# Altium schematic sheet PortSplitters.SCHDOC
size A4; DocumentNumber: 2; SheetNumber: 2; SheetTotal: 2
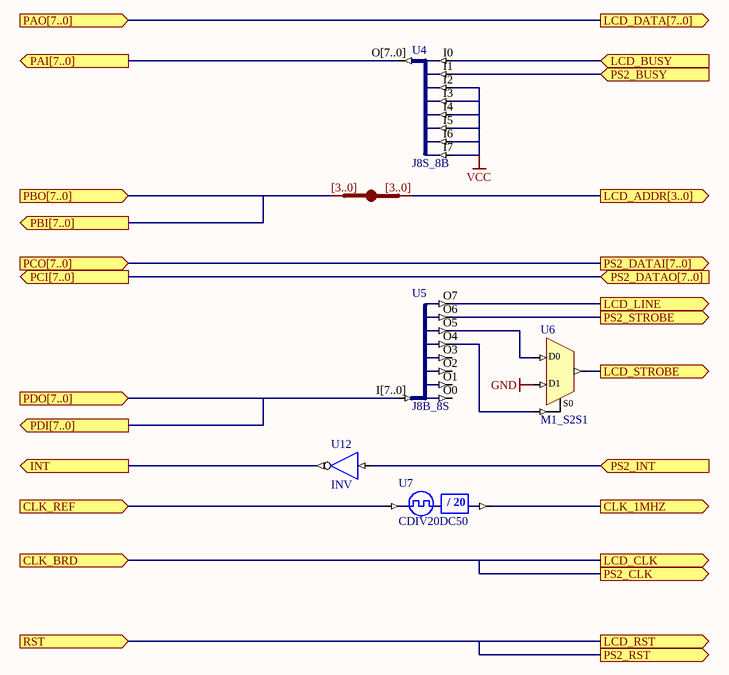
[diagram p0: PortSplitters.SCHDOC]

## Parts
JB_AUTO?  IndexA: [3..0]  (hidden comment: JB)
U4  J8S_8B
U5  J8B_8S
U6  M1_S2S1
U7  CDIV20DC50
U12  INV

## Ports
CLK_1MHZ (out), CLK_BRD (in), CLK_REF (in), INT (out), LCD_ADDR[3..0] (out), LCD_BUSY (in), LCD_CLK (out), LCD_DATA[7..0] (out), LCD_LINE (out), LCD_RST (out), LCD_STROBE (out), PAI[7..0] (out), PAO[7..0] (in), PBI[7..0] (out), PBO[7..0] (in), PCI[7..0] (out), PCO[7..0] (in), PDI[7..0] (out), PDO[7..0] (in), PS2_BUSY (in), PS2_CLK (out), PS2_DATAI[7..0] (out), PS2_DATAO[7..0] (in), PS2_INT (in), PS2_RST (out), PS2_STROBE (out), RST (in)

## Nets
GND: U6.D1
VCC: U4.I2 U4.I3 U4.I4 U4.I5 U4.I6 U4.I7
CLK_1MHZ: U7.CLKDV ; port CLK_1MHZ
CLK_BRD: port CLK_BRD, port LCD_CLK, port PS2_CLK
CLK_REF: U7.CLKIN ; port CLK_REF
INT: U12.O ; port INT
LCD_ADDR[3..0]: JB_AUTO?.B[0..0] ; port LCD_ADDR[3..0]
LCD_BUSY: U4.I0 ; port LCD_BUSY
LCD_LINE: U5.O7 ; port LCD_LINE
LCD_RST: port RST, port LCD_RST, port PS2_RST
LCD_STROBE: U6.O ; port LCD_STROBE
PAI[7..0]: U4.O[7..0] ; port PAI[7..0]
PBI[7..0]: JB_AUTO?.A[0..0] ; port PBO[7..0], port PBI[7..0]
PDI[7..0]: U5.I[7..0] ; port PDO[7..0], port PDI[7..0]
PS2_BUSY: U4.I1 ; port PS2_BUSY
PS2_INT: U12.I ; port PS2_INT
PS2_STROBE: U5.O6 ; port PS2_STROBE
NetU5_O4: U5.O4 U6.S0
NetU5_O5: U5.O5 U6.D0

Not connected (* = marked no-connect by the designer): U5 O0 O1 O2 O3

## Buses and harness runs
bus port LCD_DATA[7..0] = port PAO[7..0]
bus port PBI[7..0] = port PBO[7..0]
bus port PCI[7..0] = port PS2_DATAO[7..0]
bus port PCO[7..0] = port PS2_DATAI[7..0]
bus port PDI[7..0] = port PDO[7..0]

## Notes on the sheet
- (in symbol CDIV20DC50) / 20

## Library data of the parts
JB_AUTO? = JB: System BUS Joiner; ArchiveName: GENERIC; VHDLIB_SIM: GENERIC_LIB; Published: 29-Jan-2004; Publisher: Altium Limited; Core Revision: 1.00.00; IndexB: [3..0]
U4 = J8S_8B: 8 Single pin inputs to single 8-Bit output bus; ArchiveName: GENERIC; VHDLIB_SIM: GENERIC_LIB; Published: 29-Jan-2004; Publisher: Altium Limited; Core Revision: 1.00.00
U5 = J8B_8S: 8-Bit input bus to 8 single pin outputs; ArchiveName: GENERIC; VHDLIB_SIM: GENERIC_LIB; Published: 29-Jan-2004; Publisher: Altium Limited; Core Revision: 1.00.00
U6 = M1_S2S1: 2x1-Single Wire to 1x1-Single Wire Multiplexer; Xilinx Equivalent: M2_1; ArchiveName: GENERIC; VHDLIB_SIM: GENERIC_LIB; Published: 28-Jan-2004; Publisher: Altium Limited; Core Revision: 1.00.00
U7 = CDIV20DC50: Clock Divider by 20 with 50% Duty Cycle Output; ArchiveName: GENERIC; VHDLIB_SIM: GENERIC_LIB; Published: 29-Jan-2004; Publisher: Altium Limited; Core Revision: 1.00.00
U12 = INV: Inverter; ArchiveName: GENERIC; VHDLIB_SIM: GENERIC_LIB; Published: 29-Jan-2004; Publisher: Altium Limited; Xilinx Equivalent: INV; Core Revision: 1.00.00